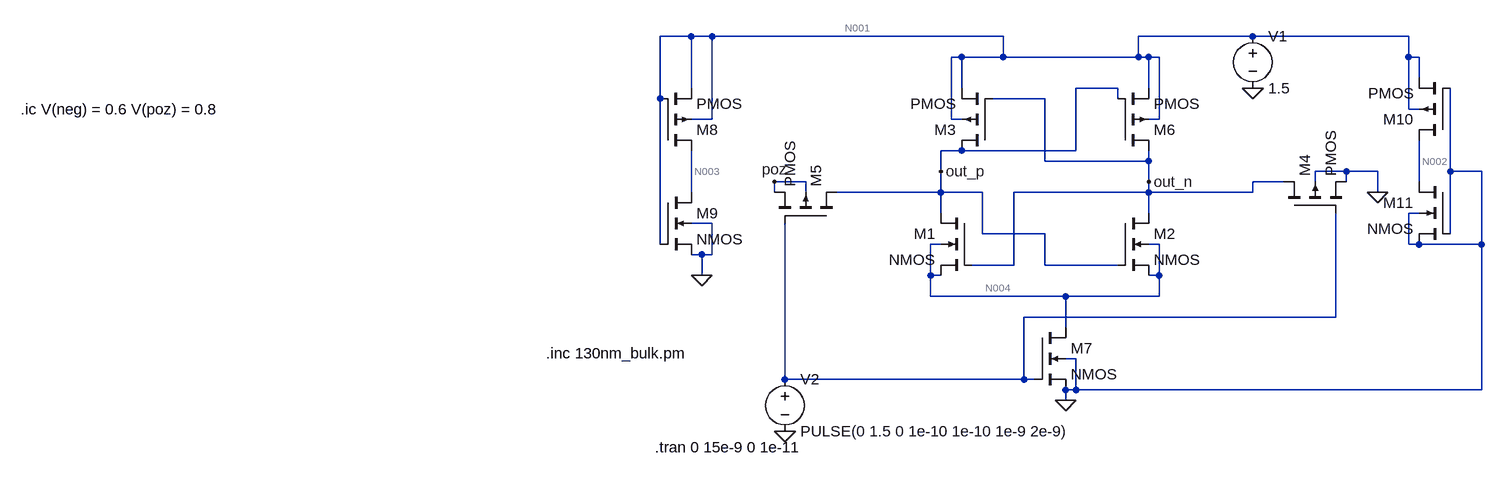
[diagram p0: schematic row_amplifaer.asc]
row_amplifaer.asc, the LTspice schematic file:
Version 4
SHEET 1 1524 724
WIRE -560 -224 -608 -224
WIRE -528 -224 -560 -224
WIRE -80 -224 -528 -224
WIRE 304 -224 128 -224
WIRE 544 -224 304 -224
WIRE -144 -192 -160 -192
WIRE -80 -192 -80 -224
WIRE -80 -192 -144 -192
WIRE 128 -192 128 -224
WIRE 128 -192 -80 -192
WIRE 144 -192 128 -192
WIRE 160 -192 144 -192
WIRE 544 -192 544 -224
WIRE 560 -192 544 -192
WIRE 560 -160 560 -192
WIRE -560 -144 -560 -224
WIRE -144 -144 -144 -192
WIRE 96 -144 32 -144
WIRE 144 -144 144 -192
WIRE -608 -128 -608 -224
WIRE -16 -128 -96 -128
WIRE 96 -128 96 -144
WIRE 544 -112 544 -192
WIRE 560 -112 544 -112
WIRE -528 -96 -528 -224
WIRE -528 -96 -560 -96
WIRE -160 -96 -160 -192
WIRE -144 -96 -160 -96
WIRE 160 -96 160 -192
WIRE 160 -96 144 -96
WIRE -144 -48 -176 -48
WIRE 32 -48 32 -144
WIRE 32 -48 -144 -48
WIRE -16 -32 -16 -128
WIRE 144 -32 144 -48
WIRE 144 -32 -16 -32
WIRE -176 -16 -176 -48
WIRE 448 -16 400 -16
WIRE 496 -16 448 -16
WIRE 608 -16 608 -144
WIRE 656 -16 608 -16
WIRE -384 0 -432 0
WIRE 144 0 144 -32
WIRE 352 0 304 0
WIRE 400 0 400 -16
WIRE 448 0 448 -16
WIRE 560 0 560 -64
WIRE -560 16 -560 -48
WIRE -432 16 -432 0
WIRE -384 16 -384 0
WIRE -176 16 -176 -16
WIRE -176 16 -336 16
WIRE -112 16 -176 16
WIRE 144 16 144 0
WIRE 144 16 -64 16
WIRE 304 16 304 0
WIRE 304 16 144 16
WIRE 496 16 496 -16
WIRE -176 48 -176 16
WIRE 144 48 144 16
WIRE 560 48 544 48
WIRE -528 64 -560 64
WIRE -112 80 -112 16
WIRE -16 80 -112 80
WIRE 608 80 608 -16
WIRE -608 96 -608 -128
WIRE -176 96 -192 96
WIRE 160 96 144 96
WIRE 544 96 544 48
WIRE 560 96 544 96
WIRE 656 96 656 -16
WIRE 656 96 560 96
WIRE -544 112 -560 112
WIRE -528 112 -528 64
WIRE -528 112 -544 112
WIRE -64 128 -64 16
WIRE -64 128 -128 128
WIRE -16 128 -16 80
WIRE 96 128 -16 128
WIRE -544 144 -544 112
WIRE -192 144 -192 96
WIRE -176 144 -192 144
WIRE 160 144 160 96
WIRE 160 144 144 144
WIRE -192 176 -192 144
WIRE 16 176 -192 176
WIRE 160 176 160 144
WIRE 160 176 16 176
WIRE 432 208 432 48
WIRE 432 208 -48 208
WIRE 16 224 16 176
WIRE 32 272 16 272
WIRE -416 304 -416 64
WIRE -48 304 -48 208
WIRE -48 304 -416 304
WIRE -32 304 -48 304
WIRE 32 320 32 272
WIRE 32 320 16 320
WIRE 656 320 656 96
WIRE 656 320 32 320
WIRE 16 336 16 320
FLAG -176 -16 out_p
FLAG 144 0 out_n
FLAG 16 336 0
FLAG 304 -144 0
FLAG -416 384 0
FLAG -544 144 0
FLAG -432 0 poz
FLAG 496 16 0
SYMBOL nmos4 -128 48 M0
SYMATTR InstName M1
SYMATTR Value2 l=130e-9 w=1300e-9 ad=676000e-18 as=676000e-18 pd=3640e-9 ps=3640e-9
SYMBOL nmos4 96 48 R0
SYMATTR InstName M2
SYMATTR Value2 l=130e-9 w=1300e-9 ad=676000e-18 as=676000e-18 pd=3640e-9 ps=3640e-9
SYMBOL pmos4 -96 -48 R180
SYMATTR InstName M3
SYMATTR Value2 l=130e-9 w=2600e-9 ad=676000e-18 as=676000e-18 pd=3640e-9 ps=3640e-9
SYMBOL pmos4 96 -48 M180
SYMATTR InstName M6
SYMATTR Value2 l=130e-9 w=12600e-9 ad=676000e-18 as=676000e-18 pd=3640e-9 ps=3640e-9
SYMBOL pmos4 352 48 R270
SYMATTR InstName M4
SYMATTR Value2 l=130e-9 w=2600e-9 ad=676000e-18 as=676000e-18 pd=3640e-9 ps=3640e-9
SYMBOL pmos4 -336 64 M270
SYMATTR InstName M5
SYMATTR Value2 l=130e-9 w=2600e-9 ad=676000e-18 as=676000e-18 pd=3640e-9 ps=3640e-9
SYMBOL nmos4 -32 224 R0
SYMATTR InstName M7
SYMATTR Value2 l=130e-9 w=1300e-9 ad=676000e-18 as=676000e-18 pd=3640e-9 ps=3640e-9
SYMBOL pmos4 -608 -48 M180
SYMATTR InstName M8
SYMATTR Value2 l=130e-9 w=12600e-9 ad=676000e-18 as=676000e-18 pd=3640e-9 ps=3640e-9
SYMBOL nmos4 -608 16 R0
SYMATTR InstName M9
SYMATTR Value2 l=130e-9 w=1300e-9 ad=676000e-18 as=676000e-18 pd=3640e-9 ps=3640e-9
SYMBOL pmos4 608 -64 R180
SYMATTR InstName M10
SYMATTR Value2 l=130e-9 w=2600e-9 ad=676000e-18 as=676000e-18 pd=3640e-9 ps=3640e-9
SYMBOL nmos4 608 0 M0
SYMATTR InstName M11
SYMATTR Value2 l=130e-9 w=1300e-9 ad=676000e-18 as=676000e-18 pd=3640e-9 ps=3640e-9
SYMBOL voltage 304 -240 R0
WINDOW 123 0 0 Left 0
WINDOW 39 0 0 Left 0
SYMATTR InstName V1
SYMATTR Value 1.5
SYMBOL voltage -416 288 R0
WINDOW 123 0 0 Left 0
WINDOW 39 0 0 Left 0
SYMATTR InstName V2
SYMATTR Value PULSE(0 1.5 0 1e-10 1e-10 1e-9 2e-9)
TEXT -616 408 Left 2 !.tran 0 15e-9 0 1e-11
TEXT -784 264 Left 2 !.inc 130nm_bulk.pm
TEXT -1592 -112 Left 2 !.ic V(neg) = 0.6 V(poz) = 0.8

The netlist it stands for:
* row_amplifaer.asc
M1 out_p out_n N004 N004 NMOS l=130e-9 w=1300e-9 ad=676000e-18 as=676000e-18 pd=3640e-9 ps=3640e-9
M2 out_n out_p N004 N004 NMOS l=130e-9 w=1300e-9 ad=676000e-18 as=676000e-18 pd=3640e-9 ps=3640e-9
M3 out_p out_n N001 N001 PMOS l=130e-9 w=2600e-9 ad=676000e-18 as=676000e-18 pd=3640e-9 ps=3640e-9
M6 out_n out_p N001 N001 PMOS l=130e-9 w=12600e-9 ad=676000e-18 as=676000e-18 pd=3640e-9 ps=3640e-9
M4 out_n N005 0 0 PMOS l=130e-9 w=2600e-9 ad=676000e-18 as=676000e-18 pd=3640e-9 ps=3640e-9
M5 out_p N005 poz poz PMOS l=130e-9 w=2600e-9 ad=676000e-18 as=676000e-18 pd=3640e-9 ps=3640e-9
M7 N004 N005 0 0 NMOS l=130e-9 w=1300e-9 ad=676000e-18 as=676000e-18 pd=3640e-9 ps=3640e-9
M8 N003 N001 N001 N001 PMOS l=130e-9 w=12600e-9 ad=676000e-18 as=676000e-18 pd=3640e-9 ps=3640e-9
M9 N003 N001 0 0 NMOS l=130e-9 w=1300e-9 ad=676000e-18 as=676000e-18 pd=3640e-9 ps=3640e-9
M10 N002 0 N001 N001 PMOS l=130e-9 w=2600e-9 ad=676000e-18 as=676000e-18 pd=3640e-9 ps=3640e-9
M11 N002 0 0 0 NMOS l=130e-9 w=1300e-9 ad=676000e-18 as=676000e-18 pd=3640e-9 ps=3640e-9
V1 N001 0 1.5
V2 N005 0 PULSE(0 1.5 0 1e-10 1e-10 1e-9 2e-9)
.model NMOS NMOS
.model PMOS PMOS
.lib standard.mos
.tran 0 15e-9 0 1e-11
.inc 130nm_bulk.pm
.ic V(neg) = 0.6 V(poz) = 0.8
.backanno
.end

* Results of the author's LTspice run, read from the files saved beside the schematic
* Operating Point, zero values left out:
*   V(out_p) = 1.036 V
*   V(out_n) = 661.9 mV
*   V(n004) = 661.9 mV
*   V(n001) = 1.5 V
*   V(poz) = 800 mV
*   V(n003) = 106.7 µV
*   V(n002) = 1.5 V
*   Id(M10) = -59.94 nA
*   Ig(M10) = -126.7 pA
*   Ib(M10) = 81.35 pA
*   Is(M10) = 59.99 nA
*   Id(M8) = -452.7 nA
*   Ig(M8) = 110.1 pA
*   Ib(M8) = 1.245 nA
*   Is(M8) = 451.3 nA
*   Id(M5) = 421.1 µA
*   Ig(M5) = -3.093 pA
*   Ib(M5) = -3.195 pA
*   Is(M5) = -421.1 µA
*   Id(M4) = 536.1 µA
*   Ib(M4) = -43.31 µA
*   Is(M4) = -492.8 µA
*   Id(M6) = -536.1 µA
*   Ib(M6) = 1.718 pA
*   Is(M6) = 536.1 µA
*   Id(M3) = -421.1 µA
*   Is(M3) = 421.1 µA
*   Id(M11) = 59.94 nA
*   Ig(M11) = -5.967 nA
*   Ib(M11) = -188.7 pA
*   Is(M11) = -53.79 nA
*   Id(M9) = 452.7 nA
*   Ig(M9) = 27.7 nA
*   Ib(M9) = -30.81 pA
*   Is(M9) = -480.4 nA
*   Id(M7) = 9.793 nA
*   Ig(M7) = -23.05 pA
*   Is(M7) = -9.769 nA
*   Id(M2) = 4.224 nA
*   Ig(M2) = 4.267 pA
*   Is(M2) = -4.228 nA
*   Id(M1) = 5.351 nA
*   Ig(M1) = -1.915 pA
*   Is(M1) = -5.349 nA
*   I(V2) = 26.42 pA
*   I(V1) = -957.8 µA
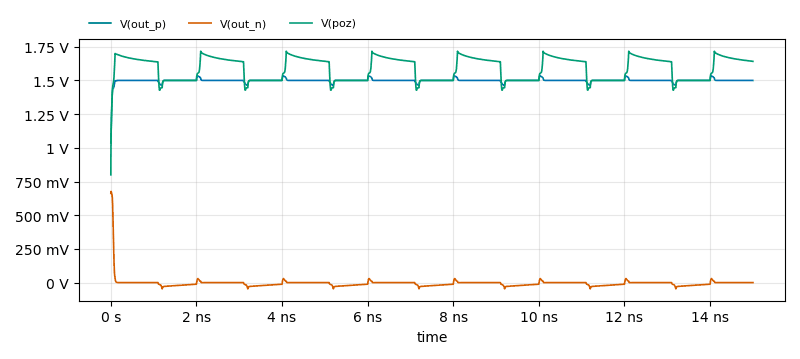
[diagram p1: Transient Analysis of row_amplifaer.asc, plotted from the saved traces]
* Transient Analysis, 1 run:
*   V(out_p): min 1.036 V, max 1.533 V, average 1.499 V, rms 1.499 V, last 1.5 V
*   V(out_n): min -46.18 mV, max 676.7 mV, average -4.796 mV, rms 41.85 mV, last 234.7 µV
*   V(poz): min 800 mV, max 1.717 V, average 1.587 V, rms 1.589 V, last 1.642 V